# EAGLE design SSB Transceiver_MC1496 Product Detector (EAGLE 9.4.2)
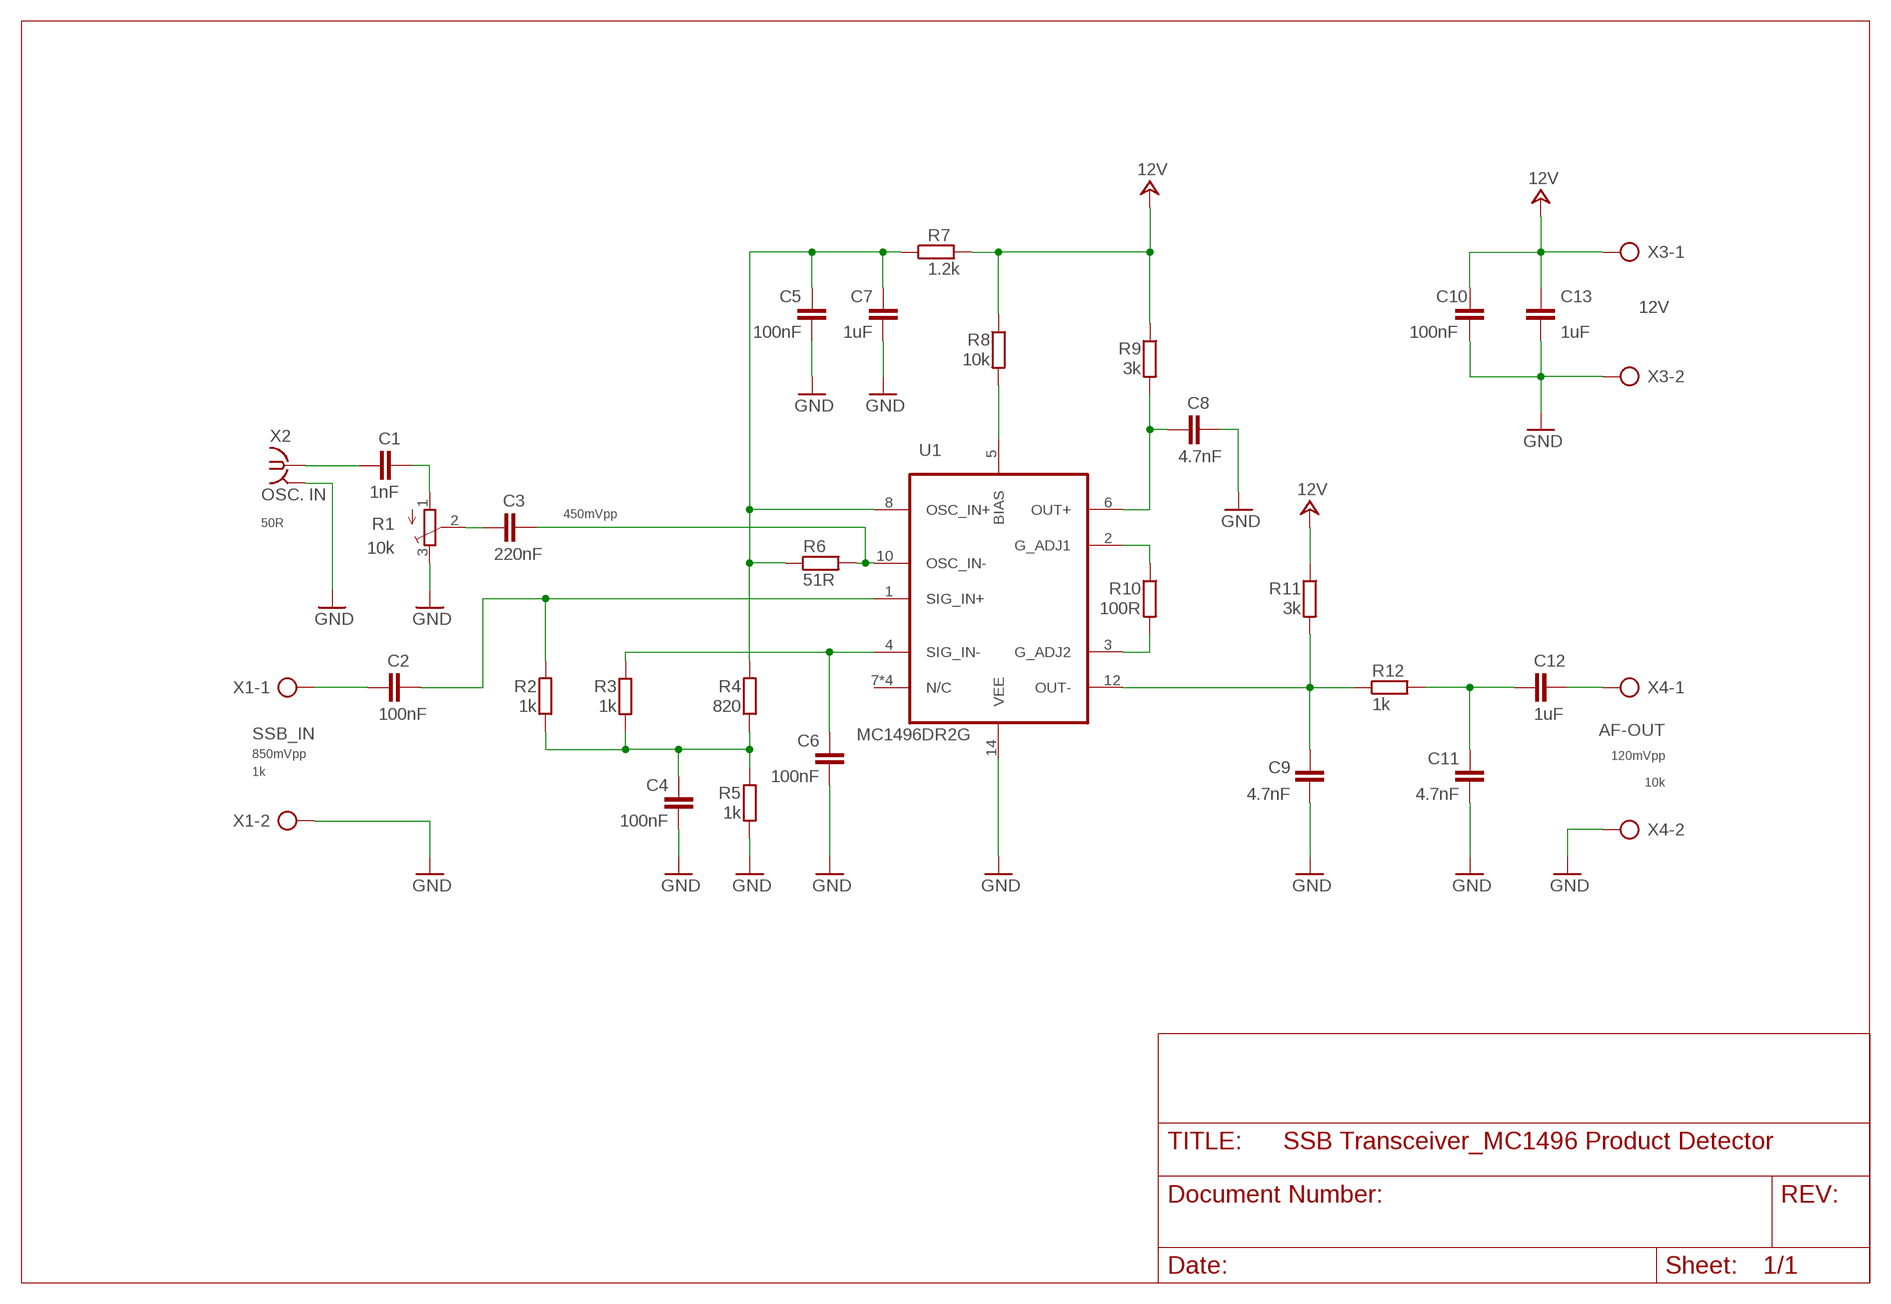
[diagram p0: schematic, sheet 1]

## Parts
C1  1nF  C-EUC0805  [C0805]
C2  100nF  C-EUC0805  [C0805]
C3  220nF  C-EUC0805  [C0805]
C4  100nF  C-EUC0805  [C0805]
C5  100nF  C-EUC0805  [C0805]
C6  100nF  C-EUC0805  [C0805]
C7  1uF  C-EUC0805  [C0805]
C8  4.7nF  C-EUC0805  [C0805]
C9  4.7nF  C-EUC0805  [C0805]
C10  100nF  C-EUC0805  [C0805]
C11  4.7nF  C-EUC0805  [C0805]
C12  1uF  C-EUC0805  [C0805]
C13  1uF  C-EUC0805  [C0805]
R1  10k  TRIM_EU-3223G  [3223G]
R2  1k  R-EU_R0805  [R0805]
R3  1k  R-EU_R0805  [R0805]
R4  820  R-EU_R0805  [R0805]
R5  1k  R-EU_R0805  [R0805]
R6  51R  R-EU_R0805  [R0805]
R7  1.2k  R-EU_R0805  [R0805]
R8  10k  R-EU_R0805  [R0805]
R9  3k  R-EU_R0805  [R0805]
R10  100R  R-EU_R0805  [R0805]
R11  3k  R-EU_R0805  [R0805]
R12  1k  R-EU_R0805  [R0805]
U1  MC1496DR2G  [SOIC127P600X175-14N]
X1  SSB_IN  AK300/2  [AK300/2]
X2  OSC. IN  SMA-142-0711-821/826  [J502-ND-142-0711-821/826]
X3  12V  AK300/2  [AK300/2]
X4  AF-OUT  AK300/2  [AK300/2]

## Nets
+24V: C10.2 C13.2 R7.2 R8.1 R9.1 R11.1 X3.1 ; supply symbol labelled 12V
GND: C4.1 C5.1 C6.1 C7.1 C8.1 C9.1 C10.1 C11.1 C13.1 R1.3(E) R5.1 U1.14(VEE) X1.2 X2.G@1 X2.G@2 X2.G@3 X2.G@4 X3.2 X4.2
N$1: C1.1 X2.1
N$2: C12.2 X4.1
N$3: C1.2 R1.1(A)
N$4: C3.1 R1.2(S)
N$5: C8.2 R9.2 U1.6(OUT+)
N$6: C9.2 R11.2 R12.1 U1.12(OUT-)
N$7: C11.2 C12.1 R12.2
N$9: R10.2 U1.3(G_ADJ2)
N$10: R10.1 U1.2(G_ADJ1)
N$11: C3.2 R6.2 U1.10(OSC_IN-)
N$13: R8.2 U1.5(BIAS)
N$16: C6.2 R3.1 U1.4(SIG_IN-)
N$17: C2.2 R2.2 U1.1(SIG_IN+)
N$18: C4.2 R2.1 R3.2 R4.1 R5.2
N$19: C2.1 X1.1
N$21: C5.2 C7.2 R4.2 R6.1 R7.1 U1.8(OSC_IN+)
Unconnected: U1.7(N/C) U1.9(N/C) U1.11(N/C) U1.13(N/C)

## Notes on the sheet
- 450mVpp
- 50R
- 120mVpp
- 850mVpp
- 1k | 10k

## Library data of the parts
C1-C13 = rcl:C-EU: CAPACITOR, European symbol; SPICEPREFIX: C
R1 = pot:TRIM_EU-: POTENTIOMETER
R2-R12 = rcl:R-EU_: RESISTOR, European symbol; SPICEPREFIX: R
U1 = Ham Radio:MC1496DR2G; AVAILABILITY: Unavailable; DESCRIPTION: RF IC Modulator/Demodulator FM 300MHz 14-SOIC; MF: ON Semiconductor; MP: MC1496DR2G; PACKAGE: SOIC-14 ON Semiconductor; PRICE: None
X1 X3 X4 = con-ptr500:AK300/2: CONNECTOR; OC_FARNELL: unknown; OC_NEWARK: unknown
X2 = con-coax:SMA-: SMA 50 Ohm End Launch Jack Receptacle - Round Contact Johnson Components Source: www.johnsoncomponents.com .. J502-ND.pdf; MF: JOHNSON COMPONENTS; MPN: 142-0711-821; OC_FARNELL: 1019328; OC_NEWARK: 16F3627

## Board
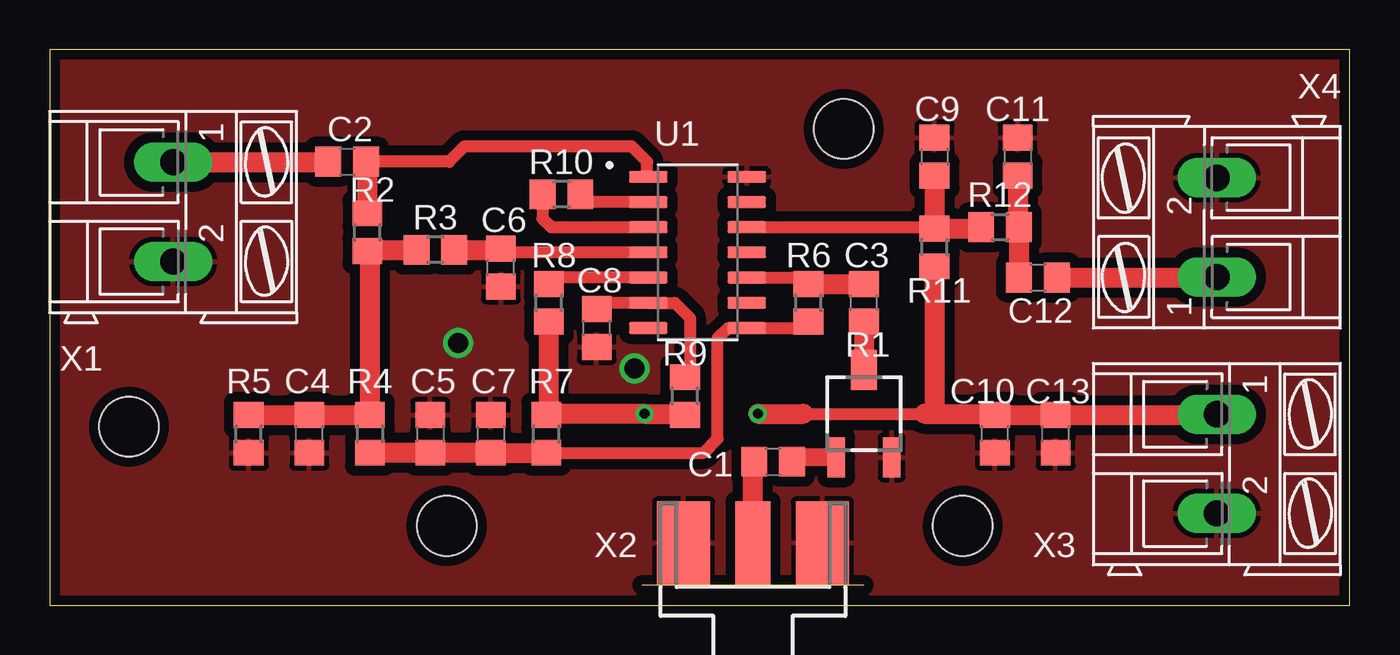
[diagram p1: board, top side]
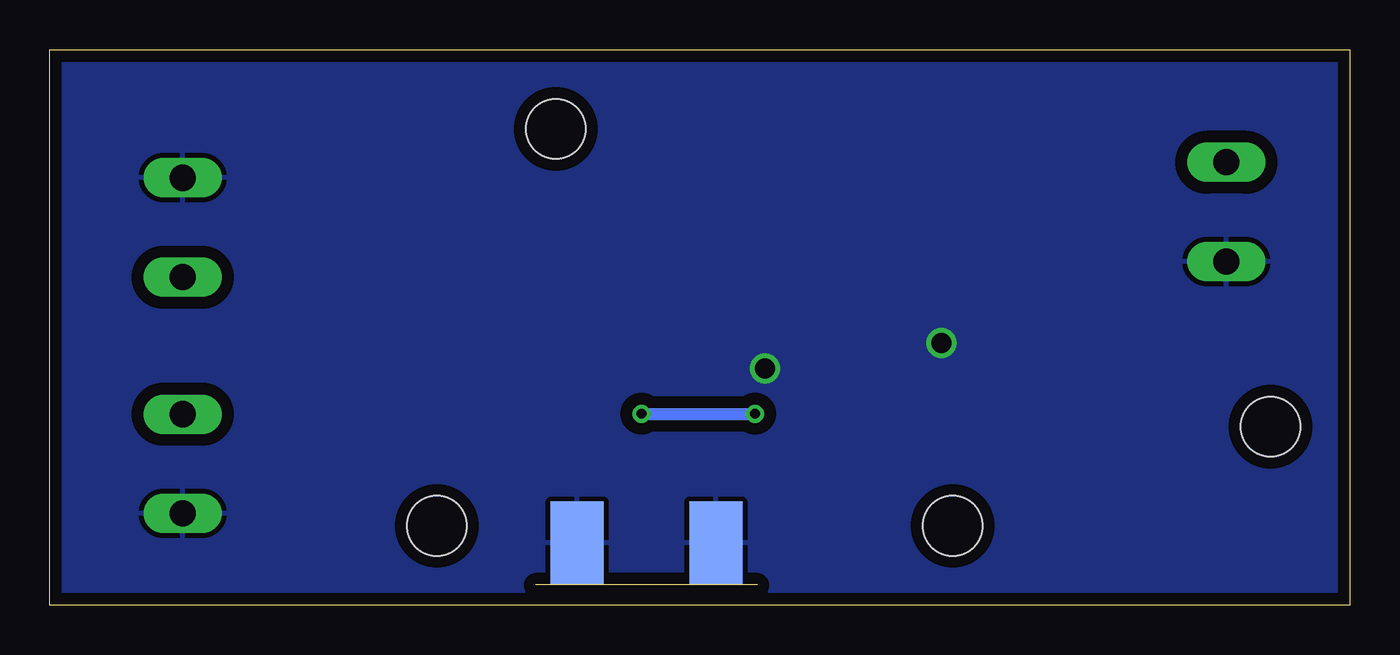
[diagram p2: board, bottom side, seen from below]

Size 65.5 x 28 mm. Coordinates in mm from the lower left corner, seen from the top.
Outline: 0,0 65.5,0 65.5,28 0,28 0,0
Copper layers (1*16): Top 0.035mm / dielectric 1.5mm / Bottom 0.035mm
Design rules "default *": minimum track width 6mil, minimum drill 0.35mm, track to track 20mil, track to pad 20mil, pad to pad 20mil, via to via 20mil, smd to smd 6mil, copper to edge 20mil, drill to drill 6mil, minimum pad ring 10mil, minimum via ring 8mil, stop-mask expansion 4mil, vias tented up to drill 0mil, thermal gap 10mil
Holes 3 mm at 20,4 4,9 40,24 46,4

### Footprints (pad centres in the part's own frame; a part is rotated, then mirrored left to right if it is on the bottom)
C0805 = smd 1.3 x 1.5: 1 -0.95,0; 2 0.95,0
3223G = smd 2 x 0.9: 1 -2.2,1.4; 3 -2.2,-1.4 | smd 2 x 1.3: 2 2.2,0
R0805 = smd 1.3 x 1.5: 1 -0.95,0; 2 0.95,0
SOIC127P600X175-14N = smd 1.95 x 0.59: 1 -2.48,3.81; 2 -2.48,2.54; 3 -2.48,1.27; 4 -2.48,0; 5 -2.48,-1.27; 6 -2.48,-2.54; 7 -2.48,-3.81; 8 2.48,-3.81; 9 2.48,-2.54; 10 2.48,-1.27; 11 2.48,0; 12 2.48,1.27; 13 2.48,2.54; 14 2.48,3.81
AK300/2 = drill 1.321 long: 1 -2.515,0; 2 2.489,0
J502-ND-142-0711-821/826 = smd 4.191 x 1.778: 1 2.115,0 | smd 4.191 x 2.667: G@1 2.115,3.495; G@2 2.115,-3.495 | smd 4.191 x 2.667 bottom: G@3 2.115,3.495; G@4 2.115,-3.495

### Placement (x,y rotation side)
C1  36.45,7.24 0 top
C2  14.99,22.35 0 top
C3  41.02,15.24 90 top
C4  13.08,8.64 90 top
C5  19.18,8.64 270 top
C6  22.73,17.02 90 top
C7  22.23,8.64 270 top
C8  27.56,13.97 90 top
C9  44.58,22.61 270 top
C10  47.62,8.64 90 top
C11  48.77,22.61 270 top
C12  49.78,16.51 0 top
C13  50.67,8.64 90 top
R1  41.02,9.65 90 top
R2  16,18.8 90 top
R3  19.43,17.91 180 top
R4  16.13,8.64 270 top
R5  10.03,8.64 90 top
R6  38.23,15.24 90 top
R7  25.02,8.64 90 top
R8  25.15,15.24 90 top
R9  32,10.54 90 top
R10  25.78,20.7 180 top
R11  44.58,18.03 90 top
R12  47.88,19.05 0 top
U1  32.64,17.78 0 top
X1  6.22,19.81 270 top
X2  35.43,1.02 90 top
X3  58.8,7.11 270 top
X4  58.8,19.05 90 top

### Tracks (layer width: path | path; a pad name or v marks a point on that pad's centre or on a via)
+24V  (via drill 0.5)
  Top 0.6: 37.97,9.65 44.07,9.65
  Top 1: X3.1 58.76,9.59 C13.2 C10.2 47.56,9.65 44.83,9.65 | v35.69,9.65 37.97,9.65 | 44.07,9.65 44.83,9.65 | R11.1 44.58,9.91 44.83,9.65 | R9.1 31.94,9.65 v29.97,9.65 25.21,9.65 25.15,9.71 | R8.1 25.15,9.71 | 25.15,9.71 R7.2
  Bottom 0.6: v35.69,9.65 v29.97,9.65
GND  (via drill 1)
  other vias: 20.57,13.21 29.46,11.94
  pour Top (isolate 0.5): 0,0 0,28 65.5,28 65.5,0
  pour Bottom (isolate 0.6): 0,0 0,28 65.5,28 65.5,0
N$1
  Top 1: X2.1 35.43,7.17 C1.1
N$2
  Top 1: C12.2 58.78,16.51 X4.1
N$3
  Top 0.9: R1.1 37.61,7.45 C1.2
N$4
  Top 1: C3.1 R1.2
N$5
  Top 0.6: C8.2 27.88,15.24 U1.6 31.5,15.24 32.26,14.48 32.26,11.74 R9.2
N$6
  Top 0.6: U1.12 44.51,19.05 R11.2
  Top 1: C9.2 44.58,19.12 44.51,19.05 | R11.2 46.86,18.98 R12.1
N$7
  Top 1: C11.2 48.77,19.11 R12.2 C12.1
N$9
  Top 0.6: R10.2 24.83,19.49 25.27,19.05 U1.3
N$10
  Top 0.6: U1.2 27.11,20.32 R10.1
N$11
  Top 0.6: U1.10 37.91,16.51 R6.2
  Top 1: R6.2 C3.2
N$13
  Top 0.6: R8.2 25.47,16.51 U1.5
N$16
  Top 0.6: U1.4 22.92,17.78 C6.2
  Top 1: R3.1 22.67,17.91 C6.2
N$17
  Top 0.6: U1.1 30.1,21.65 30.1,22.35 29.34,23.11 20.89,23.11 20.13,22.35 C2.2
  Top 1: C2.2 16,22.29 R2.2
N$18
  Top 1: R5.2 C4.2 R4.1 16.13,17.72 R2.1 16.06,17.91 R3.2
N$19
  Top 1: X1.1 14.01,22.33 C2.1
N$21
  Top 0.6: R6.1 37.91,13.97 U1.8 34.16,13.97 33.66,13.46 33.66,8.38 32.96,7.69 R7.1
  Top 1: R7.1 C7.2 C5.2 R4.2